# EAGLE design Fext (EAGLE 6.6.0)
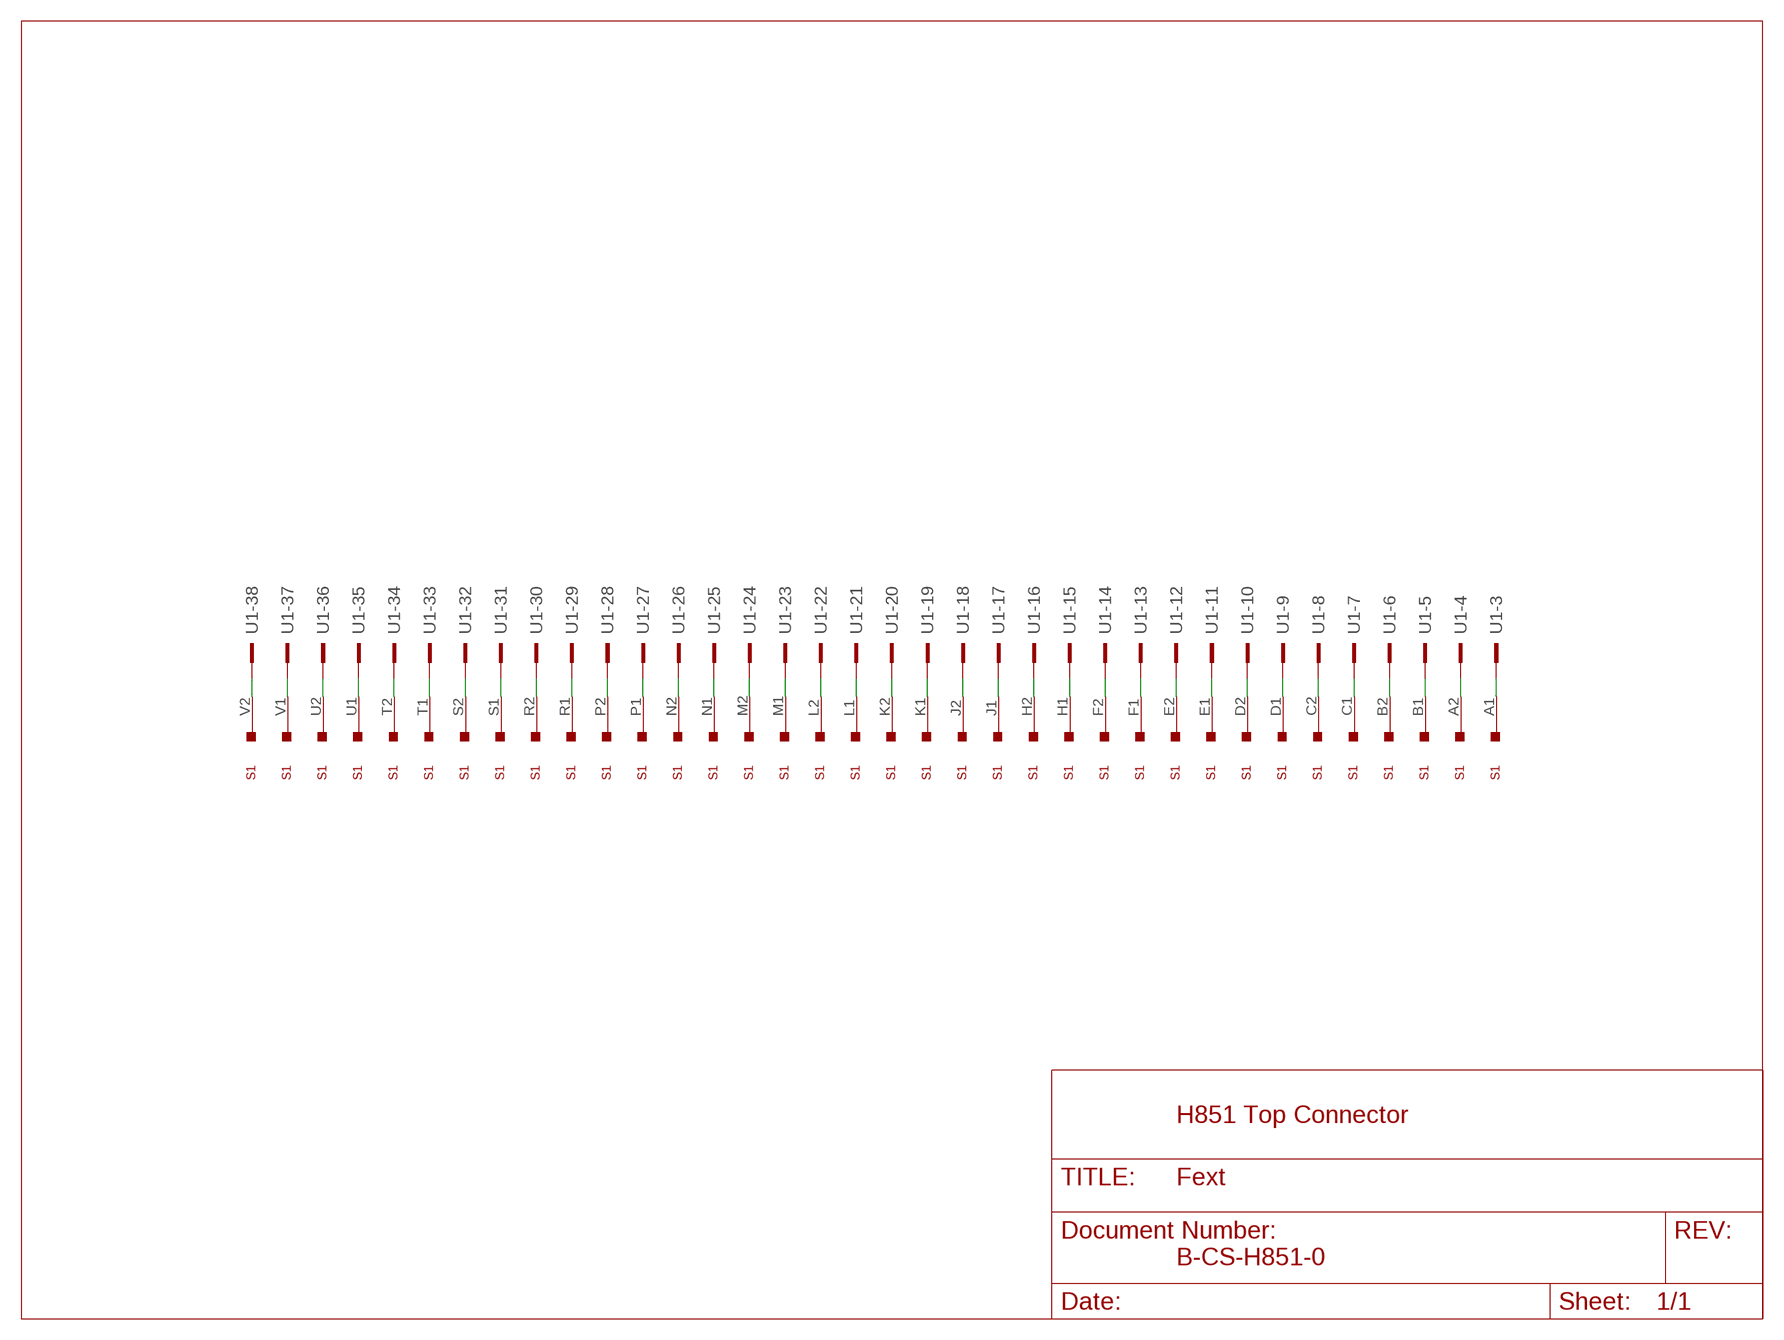
[diagram p0: schematic, sheet 1]

## Parts
S1  M916ECS  [ECS2418]
U1  40  2540-  [PAK100/2500-40]

## Nets
N$1: S1.V1 U1.37
N$2: S1.V2 U1.38
N$3: S1.U1 U1.35
N$4: S1.U2 U1.36
N$5: S1.T1 U1.33
N$6: S1.T2 U1.34
N$7: S1.S1 U1.31
N$8: S1.S2 U1.32
N$9: S1.R1 U1.29
N$10: S1.R2 U1.30
N$11: S1.P1 U1.27
N$12: S1.P2 U1.28
N$13: S1.N1 U1.25
N$14: S1.N2 U1.26
N$15: S1.M1 U1.23
N$16: S1.M2 U1.24
N$17: S1.L1 U1.21
N$18: S1.L2 U1.22
N$19: S1.K1 U1.19
N$20: S1.K2 U1.20
N$21: S1.J1 U1.17
N$22: S1.J2 U1.18
N$23: S1.H1 U1.15
N$24: S1.H2 U1.16
N$25: S1.F1 U1.13
N$26: S1.F2 U1.14
N$27: S1.E1 U1.11
N$28: S1.E2 U1.12
N$29: S1.D1 U1.9
N$30: S1.D2 U1.10
N$31: S1.C1 U1.7
N$32: S1.C2 U1.8
N$33: S1.B1 U1.5
N$34: S1.B2 U1.6
N$35: S1.A2 U1.4
N$36: S1.A1 U1.3
Unconnected: U1.1 U1.2 U1.39 U1.40

## Notes on the sheet
- H851 Top Connector
- B-CS-H851-0

## Library data of the parts
S1 = dec-m:M916: Simple 36 pin connector/wire cable
U1 = con-3m:2540-: 3M (TM) Pak 100 4-Wall Header Source: 3M; OC_FARNELL: unknown; OC_NEWARK: unknown

## Board
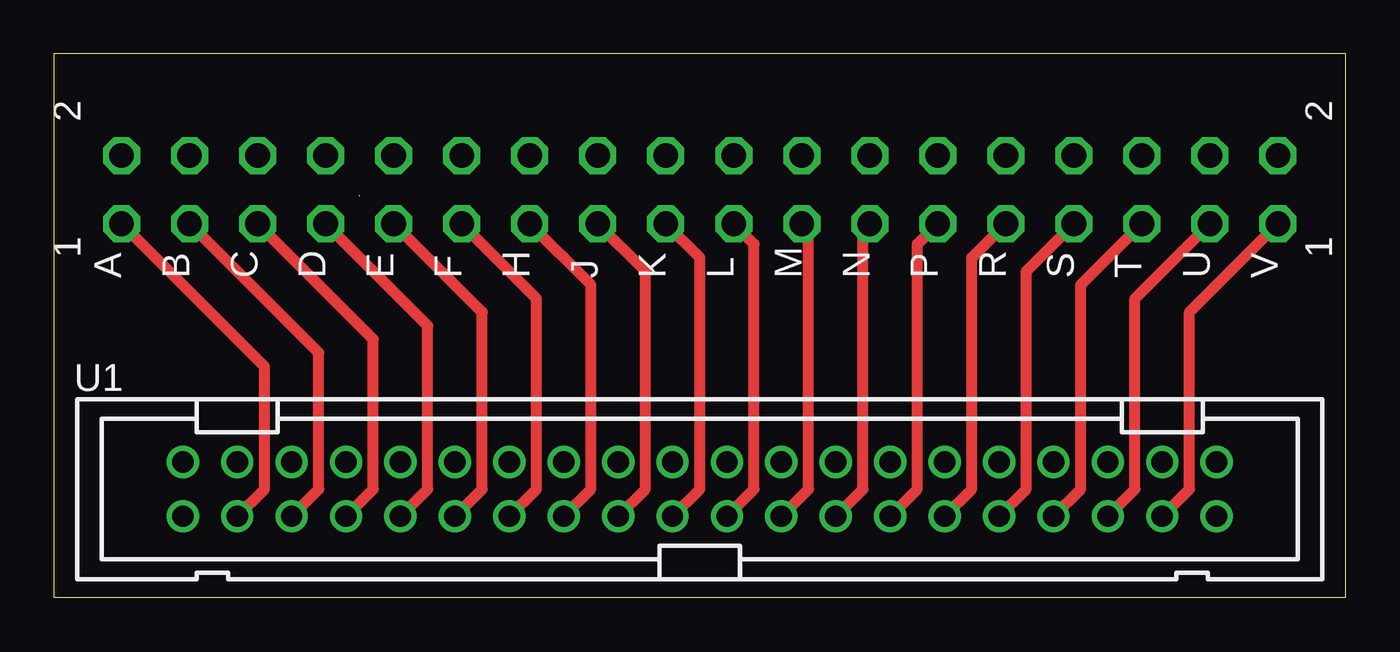
[diagram p1: board, top side]
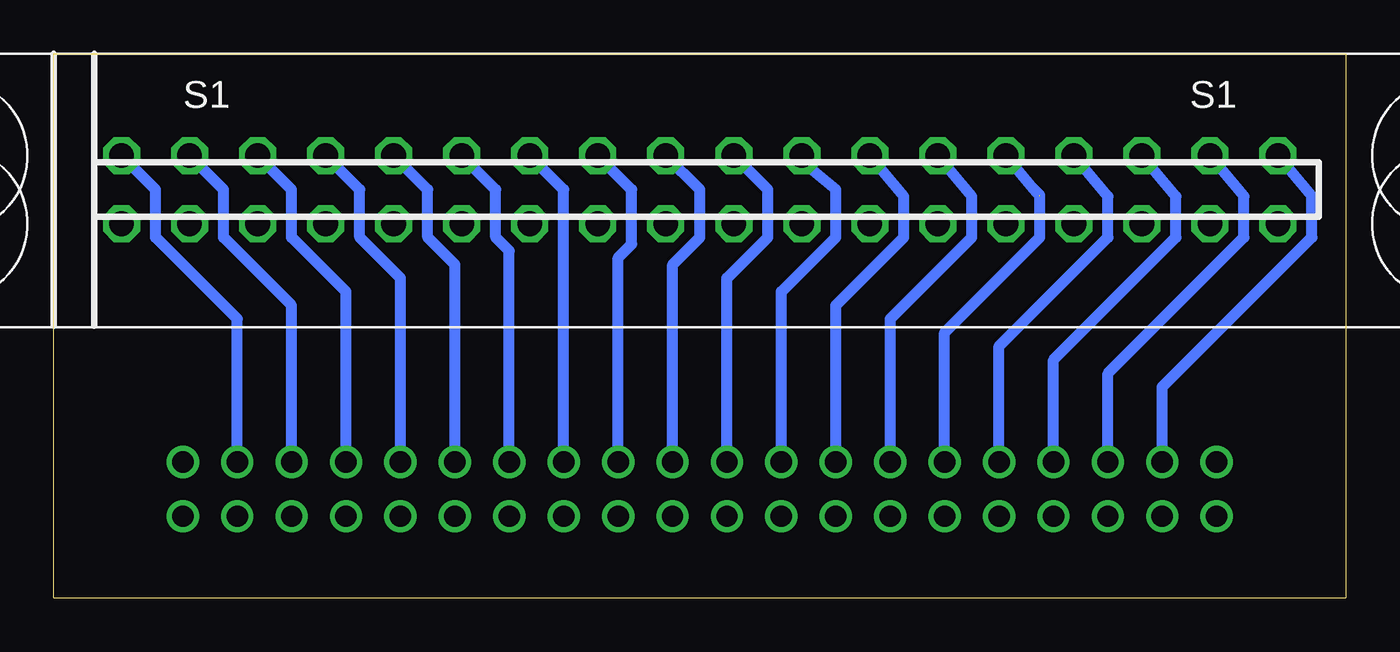
[diagram p2: board, bottom side, seen from below]

Size 60.33 x 25.4 mm. Coordinates in mm from the lower left corner, seen from the top.
Outline: 60.33,0 60.33,25.4 0,25.4 0,0 60.33,0
Copper layers (1+16): Top 0.035mm / dielectric 1.5mm / Bottom 0.035mm
Design rules "16mils *": minimum track width 16mil, minimum drill 32mil, track to track 15mil, track to pad 10mil, pad to pad 10mil, via to via 10mil, smd to smd 10mil, copper to edge 13mil, drill to drill 10mil, minimum pad ring 10mil, minimum via ring 8mil, stop-mask expansion 0mil, vias tented up to drill 0mil, thermal gap 10mil

### Footprints (pad centres in the part's own frame; a part is rotated, then mirrored left to right if it is on the bottom)
ECS2418 = drill 1.151 octagon: A1 1.587,28.575; A2 -1.587,28.575; B1 1.587,25.4; B2 -1.587,25.4; C1 1.587,22.225; C2 -1.587,22.225; D1 1.587,19.05; D2 -1.587,19.05; E1 1.587,15.875; E2 -1.587,15.875; F1 1.587,12.7; F2 -1.587,12.7; H1 1.587,9.525; H2 -1.587,9.525; J1 1.587,6.35; J2 -1.587,6.35; K1 1.587,3.175; K2 -1.587,3.175; L1 1.587,0; L2 -1.587,0; M1 1.587,-3.175; M2 -1.587,-3.175; N1 1.587,-6.35; N2 -1.587,-6.35; P1 1.587,-9.525; P2 -1.587,-9.525; R1 1.587,-12.7; R2 -1.587,-12.7; S1 1.587,-15.875; S2 -1.587,-15.875; T1 1.587,-19.05; T2 -1.587,-19.05; U1 1.587,-22.225; U2 -1.587,-22.225; V1 1.587,-25.4; V2 -1.587,-25.4
PAK100/2500-40 = drill 1 pad 1.422: 1 -24.13,-1.27; 2 -24.13,1.27; 3 -21.59,-1.27; 4 -21.59,1.27; 5 -19.05,-1.27; 6 -19.05,1.27; 7 -16.51,-1.27; 8 -16.51,1.27; 9 -13.97,-1.27; 10 -13.97,1.27; 11 -11.43,-1.27; 12 -11.43,1.27; 13 -8.89,-1.27; 14 -8.89,1.27; 15 -6.35,-1.27; 16 -6.35,1.27; 17 -3.81,-1.27; 18 -3.81,1.27; 19 -1.27,-1.27; 20 -1.27,1.27; 21 1.27,-1.27; 22 1.27,1.27; 23 3.81,-1.27; 24 3.81,1.27; 25 6.35,-1.27; 26 6.35,1.27; 27 8.89,-1.27; 28 8.89,1.27; 29 11.43,-1.27; 30 11.43,1.27; 31 13.97,-1.27; 32 13.97,1.27; 33 16.51,-1.27; 34 16.51,1.27; 35 19.05,-1.27; 36 19.05,1.27; 37 21.59,-1.27; 38 21.59,1.27; 39 24.13,-1.27; 40 24.13,1.27

### Placement (x,y rotation side)
S1  31.75,19.05 270 bottom
U1  30.16,5.08 0 top

### Tracks (layer width: path | path; a pad name or v marks a point on that pad's centre or on a via)
N$1
  Top 0.508: U1.37 53.02,5.08 53.02,13.34 S1.V1
N$2
  Bottom 0.508: U1.38 51.75,13.02 55.56,16.83 55.56,19.05 S1.V2
N$3
  Top 0.508: U1.35 50.48,5.08 50.48,13.97 S1.U1
N$4
  Bottom 0.508: U1.36 49.21,13.65 52.39,16.83 52.39,19.05 S1.U2
N$5
  Top 0.508: U1.33 47.94,5.08 47.94,14.61 S1.T1
N$6
  Bottom 0.508: U1.34 46.67,14.29 49.21,16.83 49.21,19.05 S1.T2
N$7
  Top 0.508: U1.31 45.4,5.08 45.4,15.24 S1.S1
N$8
  Bottom 0.508: U1.32 44.13,14.92 46.04,16.83 46.04,19.05 S1.S2
N$9
  Top 0.508: U1.29 42.86,5.08 42.86,15.88 S1.R1
N$10
  Bottom 0.508: S1.R2 42.86,19.05 42.86,16.83 41.59,15.56 U1.30
N$11
  Top 0.508: U1.27 40.32,5.08 40.32,16.51 S1.P1
N$12
  Bottom 0.508: S1.P2 39.69,19.05 39.69,16.83 39.05,16.19 U1.28
N$13
  Top 0.508: U1.25 37.78,5.08 37.78,17.14 S1.N1
N$14
  Bottom 0.508: S1.N2 36.51,19.05 U1.26
N$15
  Top 0.508: U1.23 35.24,5.08 35.24,17.14 S1.M1
N$16
  Bottom 0.508: S1.M2 33.34,19.05 33.34,16.51 33.97,15.88 U1.24
N$17
  Top 0.508: U1.21 32.7,5.08 32.7,16.51 S1.L1
N$18
  Bottom 0.508: U1.22 31.43,15.56 30.16,16.83 30.16,19.05 S1.L2
N$19
  Top 0.508: U1.19 30.16,5.08 30.16,15.88 S1.K1
N$20
  Bottom 0.508: S1.K2 26.99,19.05 26.99,16.83 28.89,14.92 U1.20
N$21
  Top 0.508: U1.17 27.62,5.08 27.62,15.24 S1.J1
N$22
  Bottom 0.508: S1.J2 25.72,20.64 23.81,19.05 23.81,16.83 26.35,14.29 U1.18
N$23
  Top 0.508: U1.15 25.08,5.08 25.08,14.61 S1.H1
N$24
  Bottom 0.508: S1.H2 20.64,18.73 20.64,16.83 23.81,13.65 U1.16
N$25
  Top 0.508: U1.13 22.54,5.08 22.54,13.97 S1.F1
N$26
  Bottom 0.508: S1.F2 17.46,18.73 17.46,16.83 21.27,13.02 U1.14
N$27
  Top 0.508: U1.11 20,5.08 20,13.34 S1.E1
N$28  (1 unrouted)
  Bottom 0.508: S1.E2 14.57,19.08 | 14.57,19.08 14.29,18.73 14.29,16.83 18.73,12.38 U1.12 | 14.29,18.79 14.57,19.08
N$29
  Top 0.508: U1.9 17.46,5.08 17.46,12.7 S1.D1
N$30
  Bottom 0.508: S1.D2 11.11,18.73 11.11,16.83 16.19,11.75 U1.10
N$31
  Top 0.508: U1.7 14.92,5.08 14.92,12.06 S1.C1
N$32
  Bottom 0.508: S1.C2 7.94,18.73 7.94,16.83 13.65,11.11 U1.8
N$33
  Top 0.508: U1.5 12.38,5.08 12.38,11.43 S1.B1
N$34
  Bottom 0.508: U1.6 11.11,10.48 4.76,16.83 4.76,18.73 S1.B2
N$35
  Bottom 0.508: U1.4 8.57,9.84 1.59,16.83 1.59,18.73 S1.A2
N$36
  Top 0.508: U1.3 9.84,5.08 9.84,10.79 S1.A1